# EAGLE design schematic (EAGLE 9.6.2)
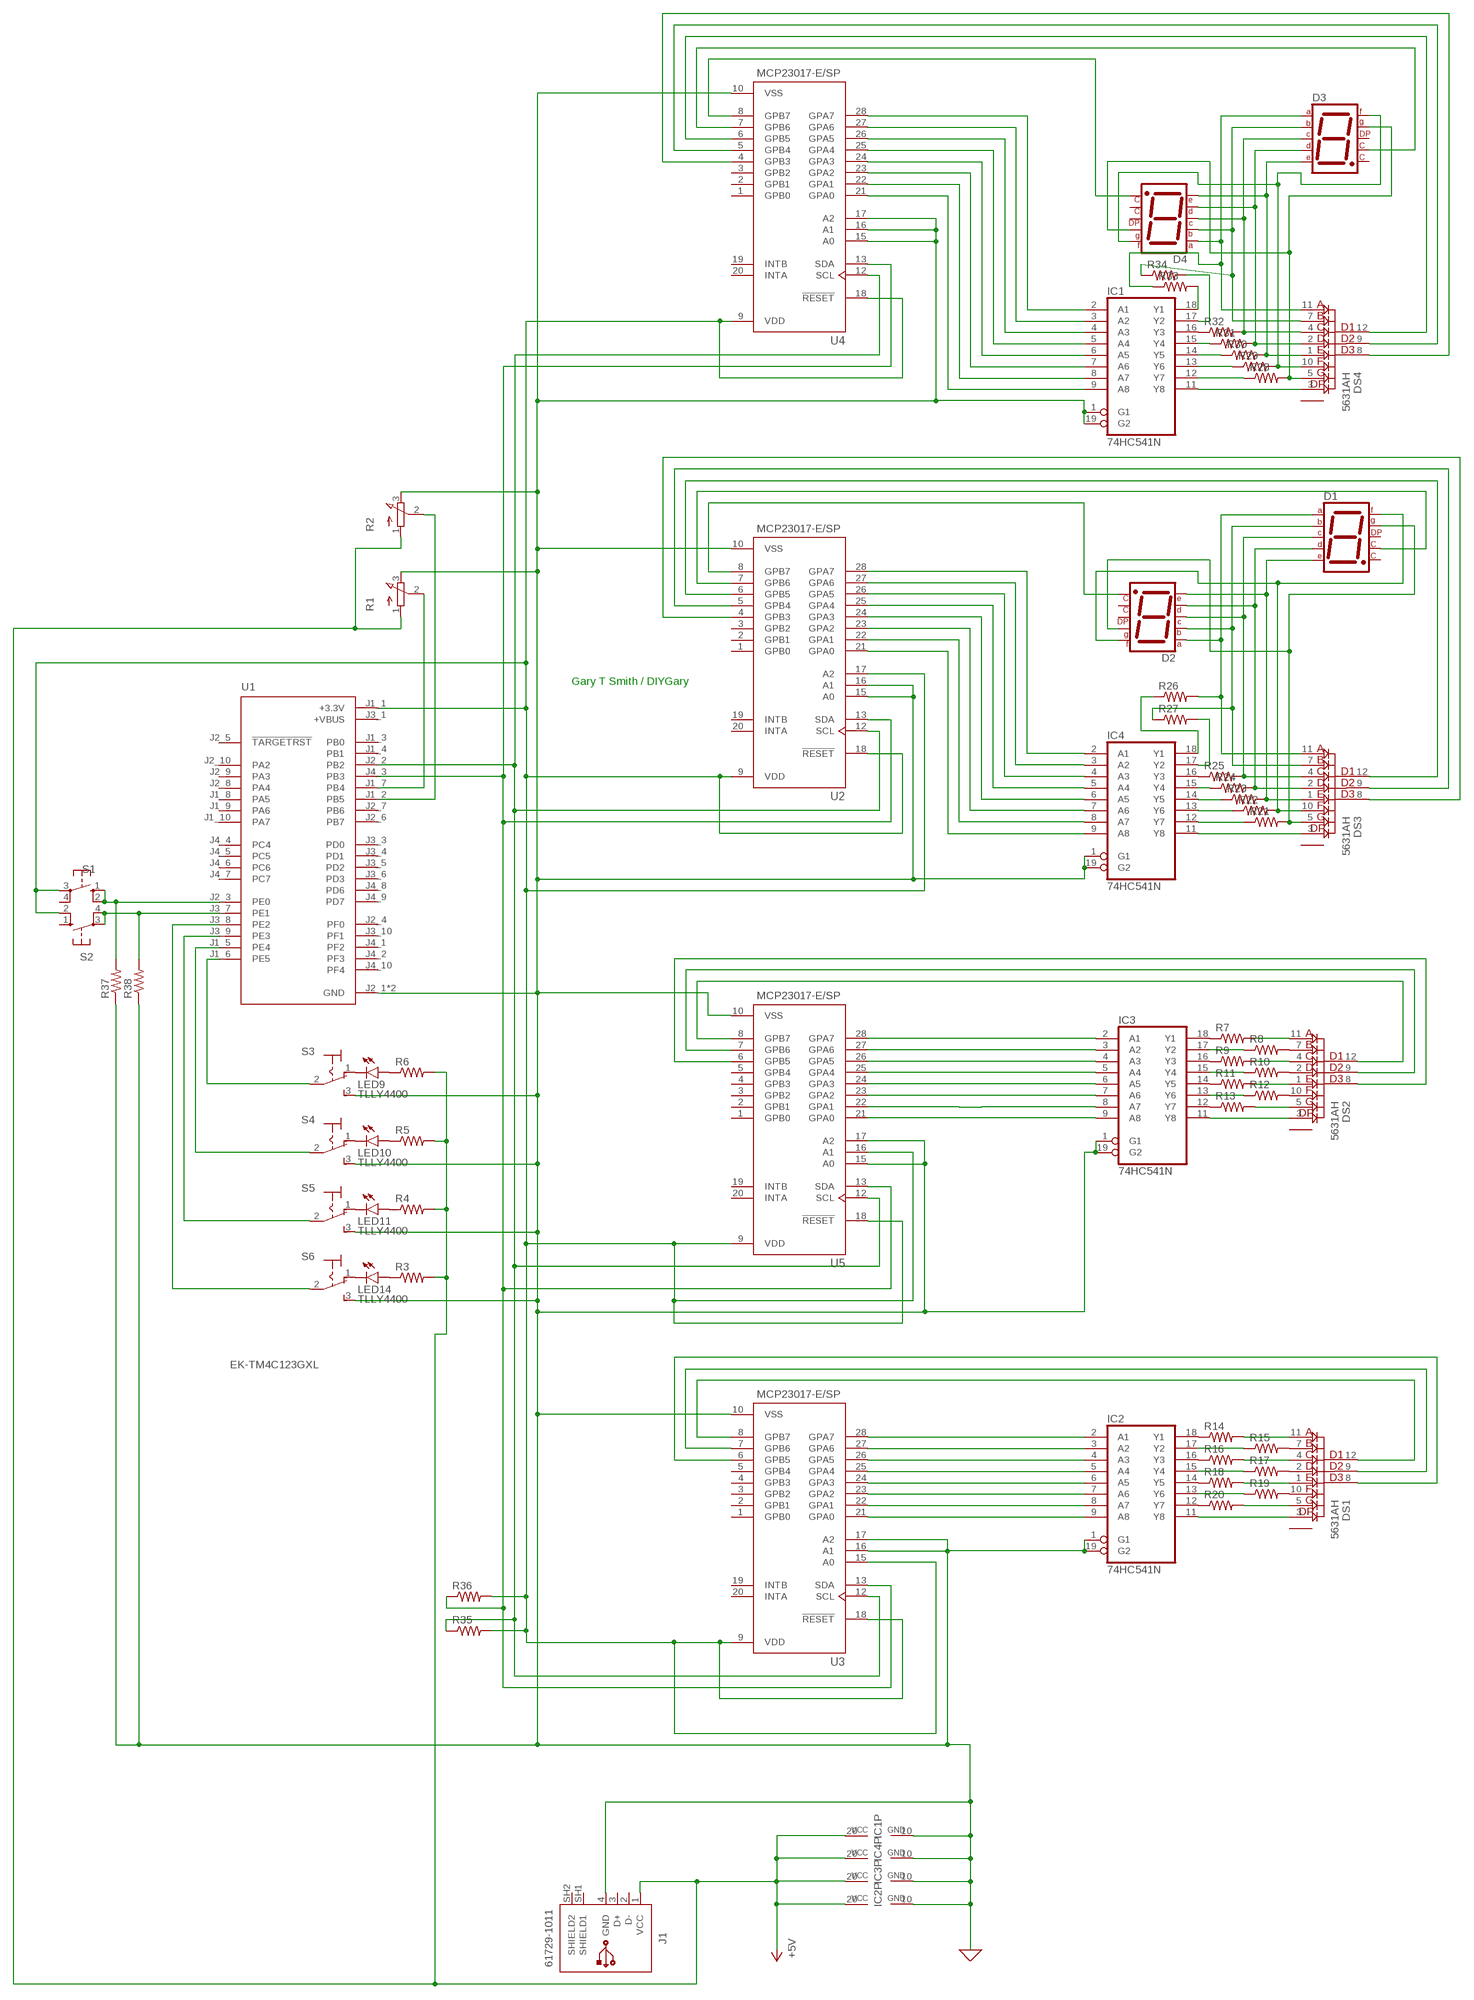
[diagram p0: schematic, sheet 1]

## Parts
D1  5611AH  [5611AH]
D2  5611AH  [5611AH]
D3  5611AH  [5611AH]
D4  5611AH  [5611AH]
DS1  5631AH  [DIPS1524W50P254L3760H835Q12N]
DS2  5631AH  [DIPS1524W50P254L3760H835Q12N]
DS3  5631AH  [DIPS1524W50P254L3760H835Q12N]
DS4  5631AH  [DIPS1524W50P254L3760H835Q12N]
IC1  74HC541N  [DIL20]
IC2  74HC541N  [DIL20]
IC3  74HC541N  [DIL20]
IC4  74HC541N  [DIL20]
J1  61729-1011  [61729-1011BLF]
LED9  TLLY4400  [LED3MM]
LED10  TLLY4400  [LED3MM]
LED11  TLLY4400  [LED3MM]
LED14  TLLY4400  [LED3MM]
R1  3RP/1610N  [3RP/1610N]
R2  3RP/1610N  [3RP/1610N]
R3  R-US_0204/7  [0204/7]
R4  R-US_0204/7  [0204/7]
R5  R-US_0204/7  [0204/7]
R6  R-US_0204/7  [0204/7]
R7  R-US_0204/7  [0204/7]
R8  R-US_0204/7  [0204/7]
R9  R-US_0204/7  [0204/7]
R10  R-US_0204/7  [0204/7]
R11  R-US_0204/7  [0204/7]
R12  R-US_0204/7  [0204/7]
R13  R-US_0204/7  [0204/7]
R14  R-US_0204/7  [0204/7]
R15  R-US_0204/7  [0204/7]
R16  R-US_0204/7  [0204/7]
R17  R-US_0204/7  [0204/7]
R18  R-US_0204/7  [0204/7]
R19  R-US_0204/7  [0204/7]
R20  R-US_0204/7  [0204/7]
R21  R-US_0204/7  [0204/7]
R22  R-US_0204/7  [0204/7]
R23  R-US_0204/7  [0204/7]
R24  R-US_0204/7  [0204/7]
R25  R-US_0204/7  [0204/7]
R26  R-US_0204/7  [0204/7]
R27  R-US_0204/7  [0204/7]
R28  R-US_0204/7  [0204/7]
R29  R-US_0204/7  [0204/7]
R30  R-US_0204/7  [0204/7]
R31  R-US_0204/7  [0204/7]
R32  R-US_0204/7  [0204/7]
R33  R-US_0204/7  [0204/7]
R34  R-US_0204/7  [0204/7]
R35  R-US_0204/7  [0204/7]
R36  R-US_0204/7  [0204/7]
R37  R-US_0204/7  [0204/7]
R38  R-US_0204/7  [0204/7]
S1  10-XX  [B3F-10XX]
S2  10-XX  [B3F-10XX]
S3  320-916  [320-916]
S4  320-916  [320-916]
S5  320-916  [320-916]
S6  320-916  [320-916]
U1  EK-TM4C123GXL  [MODULE_EK-TM4C123GXL]
U2  MCP23017-E/SP  [DIP787W45P254L3556H508Q28]
U3  MCP23017-E/SP  [DIP787W45P254L3556H508Q28]
U4  MCP23017-E/SP  [DIP787W45P254L3556H508Q28]
U5  MCP23017-E/SP  [DIP787W45P254L3556H508Q28]

## Nets
0: IC1.1(G1) IC1.10(GND) IC1.19(G2) IC2.1(G1) IC2.10(GND) IC2.19(G2) IC3.1(G1) IC3.10(GND) IC3.19(G2) IC4.1(G1) IC4.10(GND) IC4.19(G2) J1.4(GND) R1.3(E) R2.3(E) R37.1 R38.1 S3.3(S) S4.3(S) S5.3(S) S6.3(S) U1.J2_1(GND) U1.J3_2(GND) U2.10(VSS) U2.15(A0) U2.16(A1) U3.10(VSS) U3.16(A1) U3.17(A2) U4.10(VSS) U4.15(A0) U4.16(A1) U4.17(A2) U5.10(VSS) U5.15(A0) U5.17(A2) ; supply symbol labelled GND
N$1: IC1.9(A8) U4.21(GPA0)
N$2: DS1.7(A_B) R15.2
N$3: DS1.2(A_D) R17.2
N$4: DS1.10(A_F) R19.2
N$5: DS2.7(A_B) R8.2
N$6: DS2.2(A_D) R10.2
N$7: DS2.10(A_F) R12.2
N$8: D3.7(A) D4.7(A) DS4.11(A_A) R33.1
N$9: IC1.8(A7) U4.22(GPA1)
N$10: IC1.7(A6) U4.23(GPA2)
N$11: IC1.6(A5) U4.24(GPA3)
N$12: IC1.5(A4) U4.25(GPA4)
N$13: IC1.4(A3) U4.26(GPA5)
N$14: IC1.3(A2) U4.27(GPA6)
N$15: IC1.2(A1) U4.28(GPA7)
N$16: D3.3(CK1) U4.7(GPB6)
N$17: DS4.12(CC_D1) U4.6(GPB5)
N$18: DS4.9(CC_D2) U4.5(GPB4)
N$19: DS4.8(CC_D3) U4.4(GPB3)
N$20: D1.7(A) D2.7(A) DS3.11(A_A) R26.2
N$21: IC1.16(Y3) R32.1
N$22: IC1.12(Y7) R28.1
N$23: IC1.13(Y6) R29.1
N$24: D1.1(E) D2.1(E) DS3.1(A_E) R23.2
N$25: IC1.14(Y5) R30.1
N$26: IC1.15(Y4) R31.1
N$27: DS3.3(A_DP) IC4.11(Y8)
N$28: DS4.3(A_DP) IC1.11(Y8)
N$29: DS3.9(CC_D2) U2.5(GPB4)
N$30: D1.3(CK1) U2.7(GPB6)
N$31: DS3.12(CC_D1) U2.6(GPB5)
N$32: DS3.8(CC_D3) U2.4(GPB3)
N$33: IC4.9(A8) U2.21(GPA0)
N$34: IC4.8(A7) U2.22(GPA1)
N$35: IC4.7(A6) U2.23(GPA2)
N$36: IC4.6(A5) U2.24(GPA3)
N$37: IC4.5(A4) U2.25(GPA4)
N$38: IC4.4(A3) U2.26(GPA5)
N$39: IC4.3(A2) U2.27(GPA6)
N$40: IC4.2(A1) U2.28(GPA7)
N$41: IC3.18(Y1) R7.1
N$42: IC1.20(VCC) IC2.20(VCC) IC3.20(VCC) IC4.20(VCC) J1.1(VCC) R1.1(A) R2.1(A) R3.2 R4.2 R5.2 R6.2 ; supply symbol labelled +5V
N$43: IC3.16(Y3) R9.1
N$45: IC3.14(Y5) R11.1
N$47: IC3.12(Y7) R13.1
N$48: DS2.3(A_DP) IC3.11(Y8)
N$49: DS2.12(CC_D1) U5.8(GPB7)
N$50: DS2.9(CC_D2) U5.7(GPB6)
N$51: DS2.8(CC_D3) U5.6(GPB5)
N$52: IC3.2(A1) U5.28(GPA7)
N$53: IC3.3(A2) U5.27(GPA6)
N$54: IC3.4(A3) U5.26(GPA5)
N$55: IC3.5(A4) U5.25(GPA4)
N$56: IC3.6(A5) U5.24(GPA3)
N$57: IC3.7(A6) U5.23(GPA2)
N$58: IC3.8(A7) U5.22(GPA1)
N$59: IC3.9(A8) U5.21(GPA0)
N$60: IC2.2(A1) U3.28(GPA7)
N$61: IC2.3(A2) U3.27(GPA6)
N$62: IC2.4(A3) U3.26(GPA5)
N$63: IC2.5(A4) U3.25(GPA4)
N$64: IC2.6(A5) U3.24(GPA3)
N$65: IC2.7(A6) U3.23(GPA2)
N$66: IC2.8(A7) U3.22(GPA1)
N$67: IC2.9(A8) U3.21(GPA0)
N$68: IC2.18(Y1) R14.1
N$70: IC2.16(Y3) R16.1
N$72: IC2.14(Y5) R18.1
N$74: IC2.12(Y7) R20.1
N$75: DS1.3(A_DP) IC2.11(Y8)
N$76: DS1.12(CC_D1) U3.8(GPB7)
N$77: DS1.9(CC_D2) U3.7(GPB6)
N$78: DS1.8(CC_D3) U3.6(GPB5)
N$79: LED14.K(C) S6.1(O)
N$80: D2.8(CK2) U2.8(GPB7)
N$81: DS1.5(A_G) R20.2
N$82: D4.8(CK2) U4.8(GPB7)
N$83: LED10.K(C) S4.1(O)
N$87: S3.2(P) U1.J1_6(PE5)
N$88: S4.2(P) U1.J1_5(PE4)
N$89: S5.2(P) U1.J3_9(PE3)
N$90: S6.2(P) U1.J3_8(PE2)
N$91: LED14.A R3.1
N$92: LED11.K(C) S5.1(O)
N$93: LED11.A R4.1
N$95: LED9.K(C) S3.1(O)
N$96: LED10.A R5.1
N$97: LED9.A R6.1
N$98: R38.2 S2.3(P) S2.4(P1) U1.J3_7(PE1)
N$99: R37.2 S1.1(S) S1.2(S1) U1.J2_3(PE0)
N$100: R1.2(S) U1.J1_7(PB4)
N$101: R2.2(S) U1.J1_2(PB5)
N$102: R35.1 U1.J2_2(PB2) U2.12(SCL) U3.12(SCL) U4.12(SCL) U5.12(SCL)
N$103: R36.1 U1.J4_3(PB3) U2.13(SDA) U3.13(SDA) U4.13(SDA) U5.13(SDA)
N$104: R35.2 R36.2 S1.3(P) S2.2(S1) U1.J1_1(+3.3V) U2.9(VDD) U2.17(A2) U2.18(!RESET) U3.9(VDD) U3.15(A0) U3.18(!RESET) U4.9(VDD) U4.18(!RESET) U5.9(VDD) U5.16(A1) U5.18(!RESET)
N$105: IC2.13(Y6) R19.1
N$106: DS1.1(A_E) R18.2
N$107: IC2.15(Y4) R17.1
N$108: DS1.4(A_C) R16.2
N$109: IC2.17(Y2) R15.1
N$110: DS1.11(A_A) R14.2
N$111: DS2.5(A_G) R13.2
N$112: IC3.13(Y6) R12.1
N$113: DS2.1(A_E) R11.2
N$114: IC3.15(Y4) R10.1
N$115: DS2.4(A_C) R9.2
N$116: IC3.17(Y2) R8.1
N$117: DS2.11(A_A) R7.2
N$118: IC1.18(Y1) R33.2
N$119: D1.6(B) D2.6(B) DS3.7(A_B) R27.1
N$120: D1.4(C) D2.4(C) DS3.4(A_C) R25.2
N$121: D1.2(D) D2.2(D) DS3.2(A_D) R24.2
N$123: D1.9(F) D2.9(F) DS3.10(A_F) R22.2
N$124: D1.10(G) D2.10(G) DS3.5(A_G) R21.2
N$125: IC1.17(Y2) R34.2
N$126: D3.6(B) D4.6(B) DS4.7(A_B) R34.1
N$127: D3.4(C) D4.4(C) DS4.4(A_C) R32.2
N$128: D3.2(D) D4.2(D) DS4.2(A_D) R31.2
N$129: D3.1(E) D4.1(E) DS4.1(A_E) R30.2
N$130: D3.9(F) D4.9(F) DS4.10(A_F) R29.2
N$131: D3.10(G) D4.10(G) DS4.5(A_G) R28.2
N$132: IC4.16(Y3) R25.1
N$133: IC4.15(Y4) R24.1
N$134: IC4.14(Y5) R23.1
N$135: IC4.13(Y6) R22.1
N$136: IC4.12(Y7) R21.1
N$137: IC4.18(Y1) R26.1
N$138: IC4.17(Y2) R27.2
Unconnected: D1.5(DP) D1.8(CK2) D2.3(CK1) D2.5(DP) D3.5(DP) D3.8(CK2) D4.3(CK1) D4.5(DP) DS1.6(NC) DS2.6(NC) DS3.6(NC) DS4.6(NC) J1.2(D-) J1.3(D+) J1.SH1(SHIELD1) J1.SH2(SHIELD2) S1.4(P1) S2.1(S) U1.J1_3(PB0) U1.J1_4(PB1) U1.J1_8(PA5) U1.J1_9(PA6) U1.J1_10(PA7) U1.J2_4(PF0) U1.J2_5(!TARGETRST) U1.J2_6(PB7) U1.J2_7(PB6) U1.J2_8(PA4) U1.J2_9(PA3) U1.J2_10(PA2) U1.J3_3(PD0) U1.J3_4(PD1) U1.J3_5(PD2) U1.J3_6(PD3) U1.J3_10(PF1) U1.J4_1(PF2) U1.J4_2(PF3) U1.J4_4(PC4) U1.J4_5(PC5) U1.J4_6(PC6) U1.J4_7(PC7) U1.J4_8(PD6) U1.J4_9(PD7) U1.J4_10(PF4) U2.1(GPB0) U2.2(GPB1) U2.3(GPB2) U2.19(INTB) U2.20(INTA) U3.1(GPB0) U3.2(GPB1) U3.3(GPB2) U3.4(GPB3) U3.5(GPB4) U3.19(INTB) U3.20(INTA) U4.1(GPB0) U4.2(GPB1) U4.3(GPB2) U4.19(INTB) U4.20(INTA) U5.1(GPB0) U5.2(GPB1) U5.3(GPB2) U5.4(GPB3) U5.5(GPB4) U5.19(INTB) U5.20(INTA)

## Notes on the sheet
- Gary T Smith / DIYGary

## Power pins joined to a net without a drawn wire
+VBUS: U1.J3_1(+VBUS)

## Library data of the parts
D1-D4 = 5611AH:5611AH: 7-segment DISPLAY single cathode, 13 mm
DS1-DS4 = 5631AH:5631AH: LED Displays & Accessories 14mm THREE DIGIT Source: Datasheet <http://www.us.kingbright.com/images/catalog/SPEC/BC56-12SRWA.pdf>; DESCRIPTION: LED Displays & Accessories 14mm THREE DIGIT; HEIGHT: 8.35mm; MANUFACTURER_NAME: Kingbright; MANUFACTURER_PART_NUMBER: BC56-12SRWA; MOUSER_PART_NUMBER: 604-BC56-12SRWA; MOUSER_PRICE-STOCK: https://www.mouser.co.uk/ProductDetail/Kingbright/BC56-12SRWA?qs=VbHzlErGQr623J%252B7XTexpw%3D%3D
IC1-IC4 = 74xx-eu:74*541: Octal BUFFER and LINE DRIVER, 3-state
J1 = Connector_USB:61729-1011: USB(2.0) Type-B, RCPT, 4POS, THT-R/A Datasheet <https://www.amphenol-icc.com/media/wysiwyg/files/drawing/61729.pdf>; CATEGORY: Connector; CONTACTS: 4; CURRENT_RATING: 1A; DESCRIPTION: CONN RCPT USB2.0 TYPEB 4POS R/A; GENDER: Receptacle; MANUFACTURER: Amphenol ICC (FCI); MOUNT_TYPE: R/A; MPN: 61729-1011BLF; OPERATING_TEMP: -55°C to 85°C; PART_STATUS: Active; ROHS_COMPLIANT: RoHS Compliant; SERIES: 61729; SUB-CATEGORY: USB; TYPE: USB-B
LED9-LED11 LED14 = led:TLLY4400: Low Current (2mA) LED 3 mm Tinted Diffused Package color YELLOW Source: Data sheet <http://www.farnell.com/datasheets/391098.pdf>; MF: VISHAY SEMICONDUCTOR; OC_FARNELL: 1612439
R1 R2 = pot:3RP/1610N: 16mm Potentiometer one level Source: http://www.alphapotentiometers.net/html/16mm_pot_2.html
R3-R38 = rcl:R-US_: RESISTOR, American symbol; SPICEPREFIX: R
S1 S2 = switch-omron:10-XX: OMRON SWITCH; MPN: B3F-1000; OC_FARNELL: 176432; OC_NEWARK: 36M3542
S3-S6 = switch:320-916: TOGGLE SWITCH distributor RS Components
U1 = EK-TM4C123GXL:EK-TM4C123GXL: ARM® Cortex®-M4F Based MCU TM4C123G LaunchPad™ Evaluation Kit Check prices <https://pricing.snapeda.com/parts/EK-TM4C123GXL/Texas%20Instruments/view-part?ref=eda>; AVAILABILITY: Warning; DESCRIPTION: ARM® Cortex®-M4F Based MCU TM4C123G LaunchPad™ Evaluation Kit; MF: Texas Instruments; MP: EK-TM4C123GXL; PACKAGE: None; PRICE: None; PURCHASE-URL: https://pricing.snapeda.com/search/part/EK-TM4C123GXL/?ref=eda
U2-U5 = MCP23017-E_SP:MCP23017-E/SP: MCP23017 Series 5.5 V 1.7 MHz SMT 16-Bit I2C I/O Expander - SPDIP-28 Check prices <https://pricing.snapeda.com/parts/MCP23017-E/SP/Microchip%20Technology/view-part?ref=eda>; AVAILABILITY: In Stock; DESCRIPTION: I/O Expander 16 I²C 1.7MHz 28-SPDIP; MF: Microchip Technology; MP: MCP23017-E/SP; PACKAGE: DIP-28 Microchip; PRICE: None

## Board
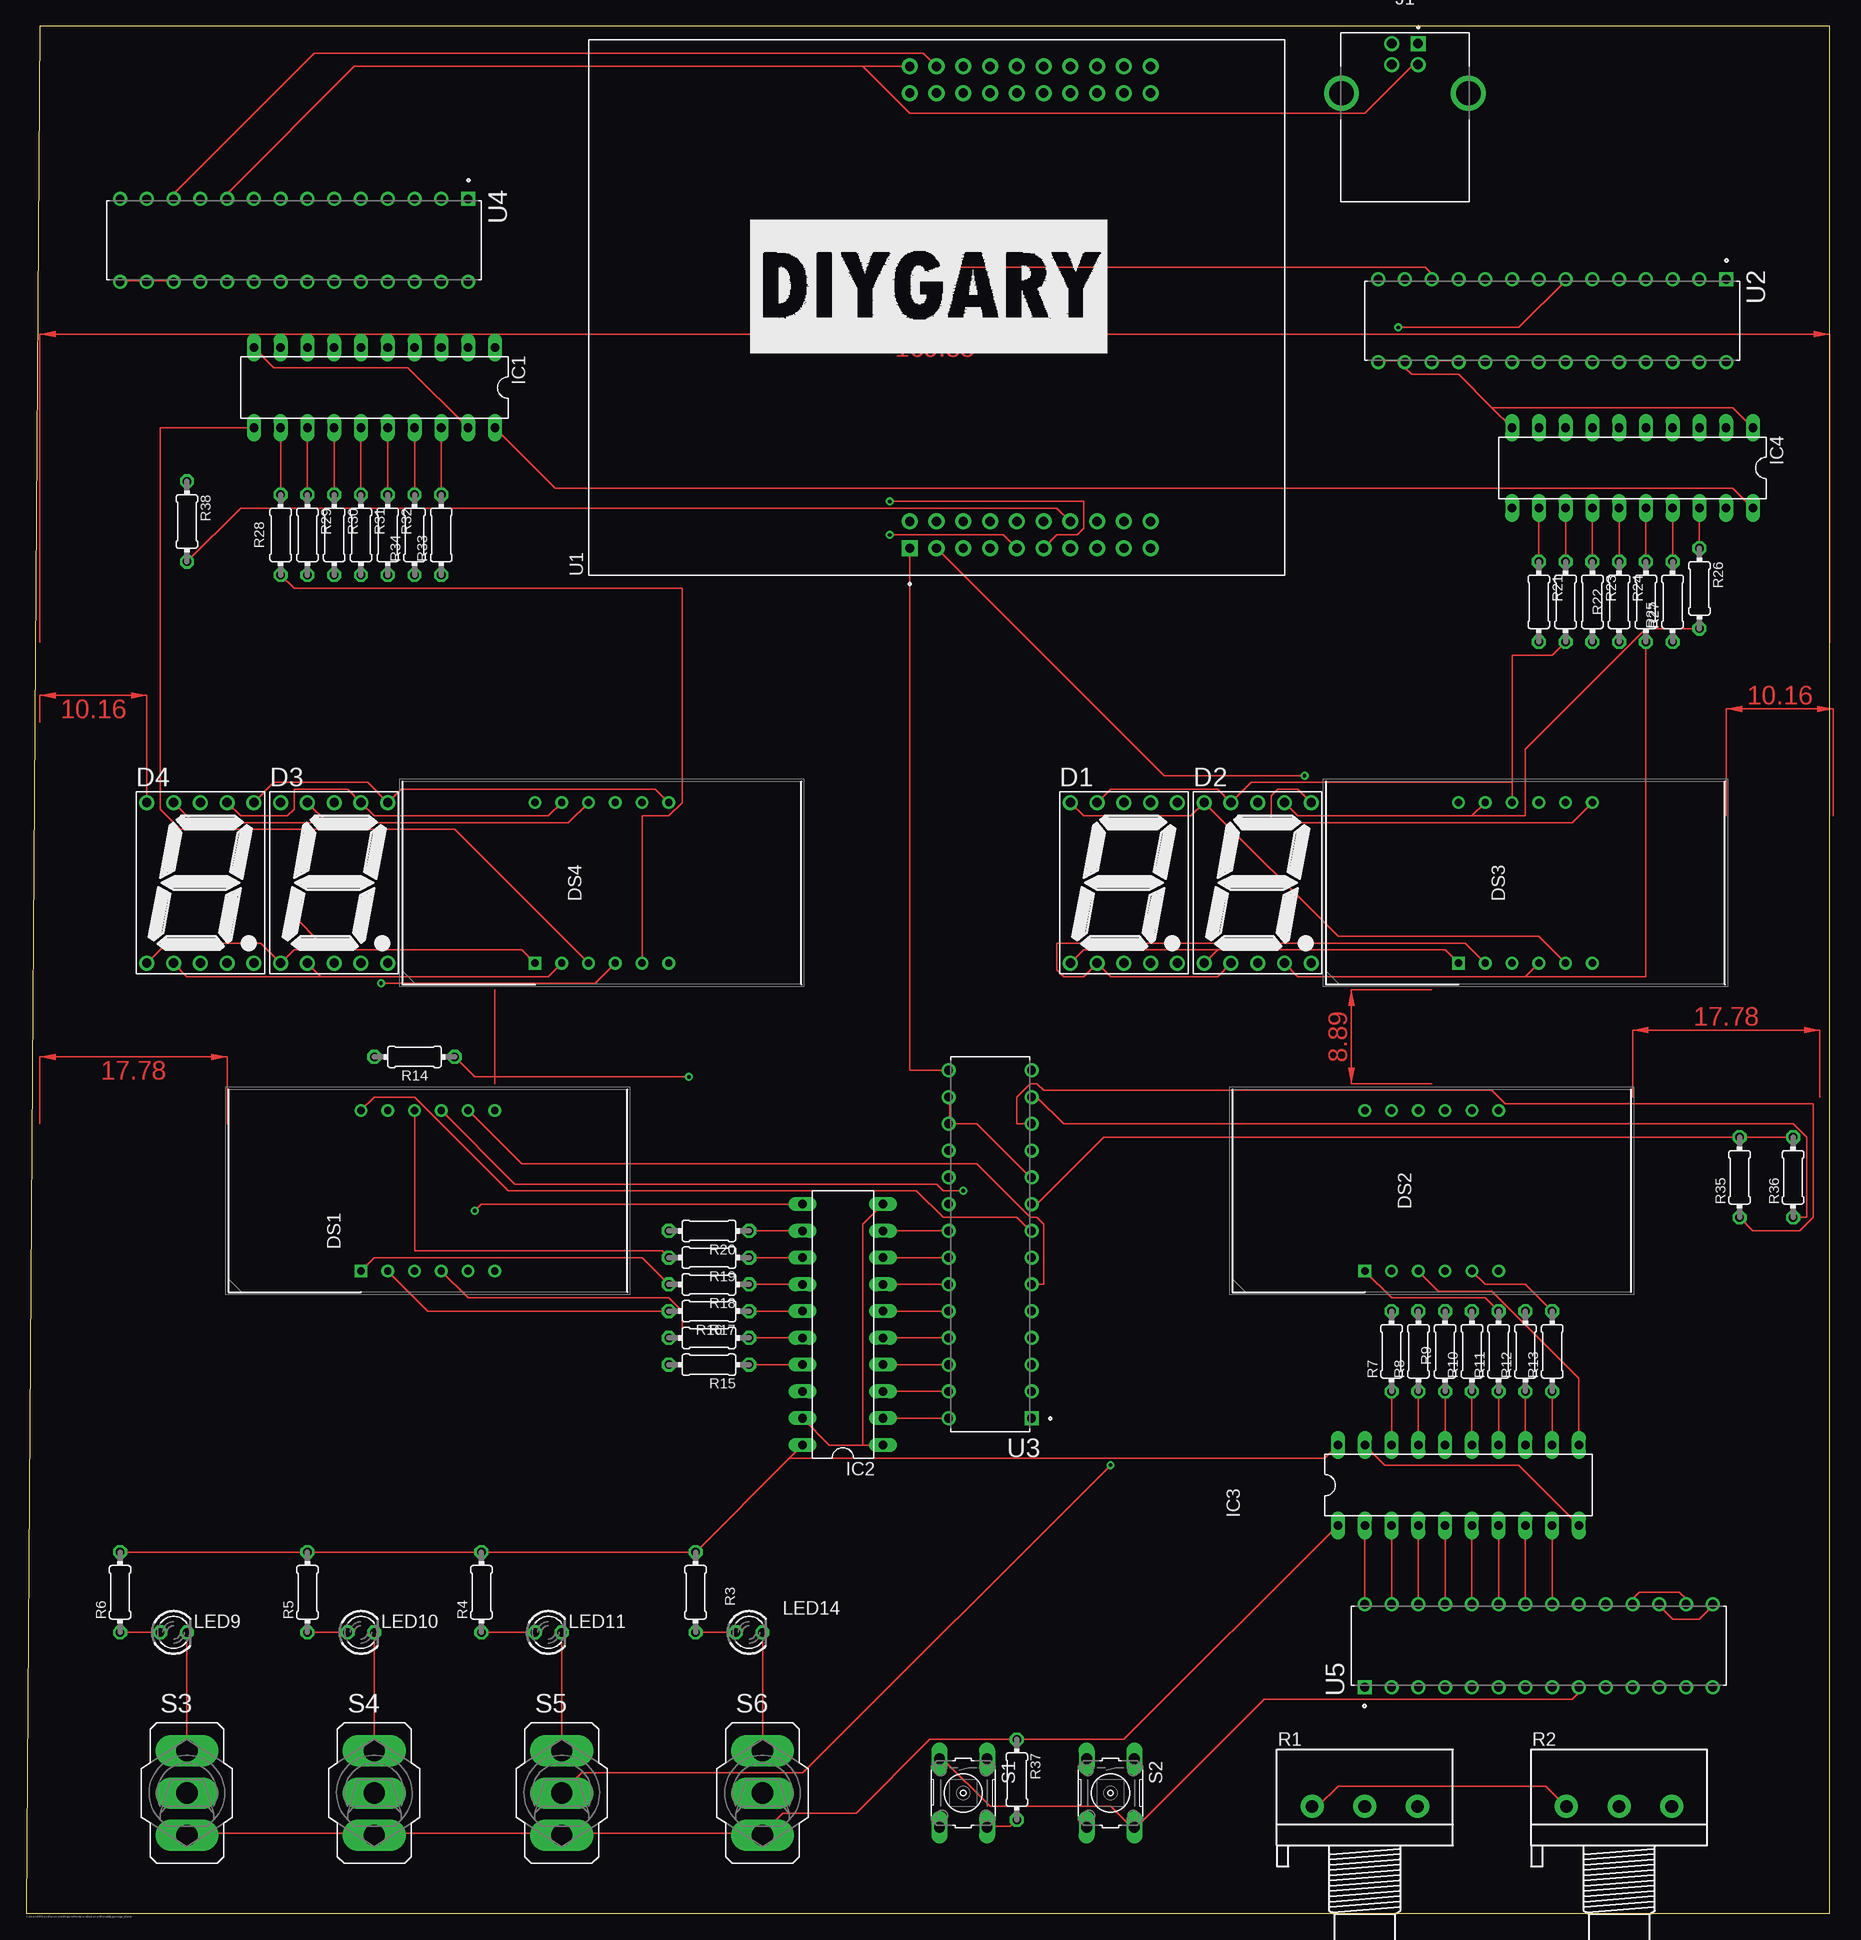
[diagram p1: board, top side]
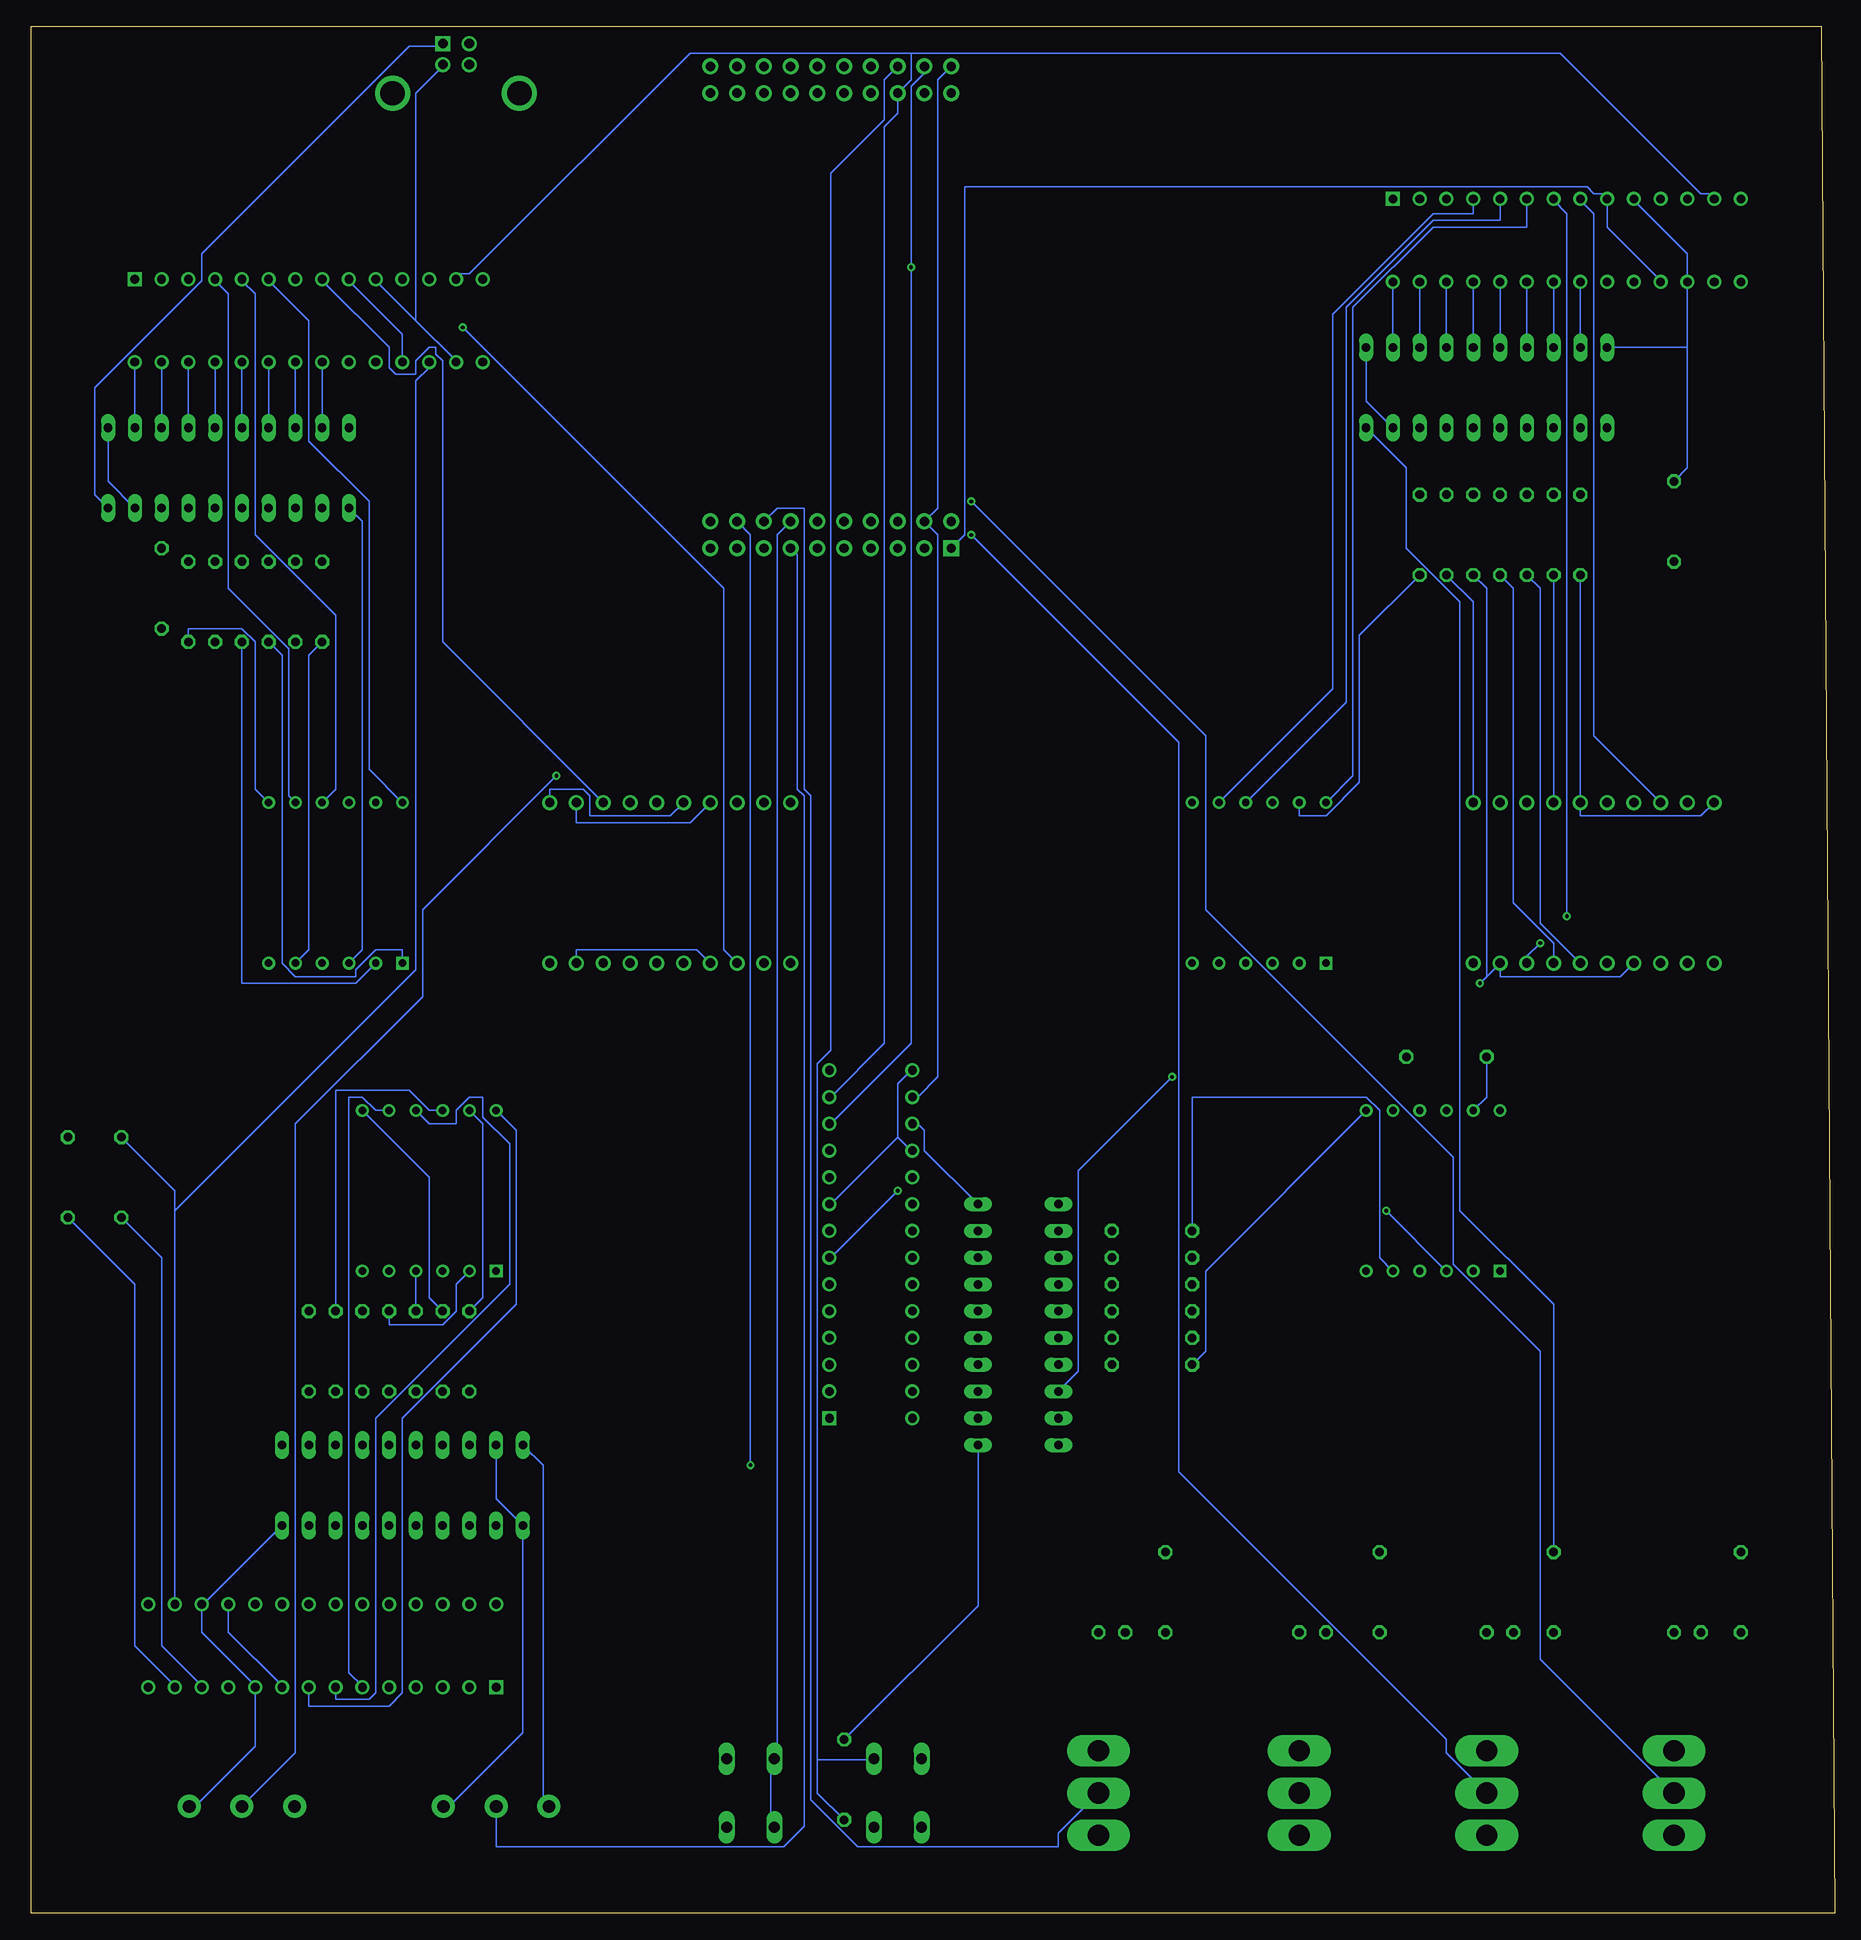
[diagram p2: board, bottom side, seen from below]

Size 171.12 x 179.06 mm. Coordinates in mm from the lower left corner, seen from the top.
Outline: 0,0 171.12,0 171.12,179.06 1.27,179.06 0,0
Copper layers (1*16): Top 0.035mm / dielectric 1.5mm / Bottom 0.035mm
Design rules "default": minimum track width 6mil, minimum drill 0.35mm, track to track 6mil, track to pad 6mil, pad to pad 6mil, via to via 6mil, smd to smd 6mil, copper to edge 40mil, drill to drill 6mil, minimum pad ring 10mil, minimum via ring 8mil, stop-mask expansion 4mil, vias tented up to drill 0mil, thermal gap 10mil

### Footprints (pad centres in the part's own frame; a part is rotated, then mirrored left to right if it is on the bottom)
5611AH = drill 0.889 pad 1.422: 1 -5.08,-7.62; 2 -2.54,-7.62; 3 0,-7.62; 4 2.54,-7.62; 5 5.08,-7.62; 6 5.08,7.62; 7 2.54,7.62; 8 0,7.62; 9 -2.54,7.62; 10 -5.08,7.62
DIPS1524W50P254L3760H835Q12N = drill 0.7 pad 1.1 square: 1 0,0 | drill 0.7 pad 1.1: 2 0,-2.54; 3 0,-5.08; 4 0,-7.62; 5 0,-10.16; 6 0,-12.7; 7 15.24,-12.7; 8 15.24,-10.16; 9 15.24,-7.62; 10 15.24,-5.08; 11 15.24,-2.54; 12 15.24,0
DIL20 = drill 0.813 long: 1 -11.43,-3.81; 2 -8.89,-3.81; 3 -6.35,-3.81; 4 -3.81,-3.81; 5 -1.27,-3.81; 6 1.27,-3.81; 7 3.81,-3.81; 8 6.35,-3.81; 9 8.89,-3.81; 10 11.43,-3.81; 11 11.43,3.81; 12 8.89,3.81; 13 6.35,3.81; 14 3.81,3.81; 15 1.27,3.81; 16 -1.27,3.81; 17 -3.81,3.81; 18 -6.35,3.81; 19 -8.89,3.81; 20 -11.43,3.81
61729-1011BLF = drill 0.92 square: 1 1.25,4.71 | drill 0.92: 2 -1.25,4.71; 3 -1.25,2.71; 4 1.25,2.71 | drill 2.3: SH1 -6.02,0; SH2 6.02,0
LED3MM = drill 0.813 octagon: A -1.27,0; K 1.27,0
3RP/1610N = drill 1.2 pad 2.184: 1 -5,0; 2 0,0; 3 5,0
0204/7 = drill 0.813 octagon: 1 -3.81,0; 2 3.81,0
B3F-10XX = drill 1.016 long: 1 -3.251,2.261; 2 3.251,2.261; 3 -3.251,-2.261; 4 3.251,-2.261
320-916 = drill 2.007 long: 1 0,4.013; 2 0,0; 3 0,-4.013
MODULE_EK-TM4C123GXL = drill 0.89 pad 1.52 square: J1_1 -22.86,2.54 | drill 0.89 pad 1.52: J1_2 -22.86,0; J1_3 -22.86,-2.54; J1_4 -22.86,-5.08; J1_5 -22.86,-7.62; J1_6 -22.86,-10.16; J1_7 -22.86,-12.7; J1_8 -22.86,-15.24; J1_9 -22.86,-17.78; J1_10 -22.86,-20.32; J2_1 22.86,2.54; J2_2 22.86,0; J2_3 22.86,-2.54; J2_4 22.86,-5.08; J2_5 22.86,-7.62; J2_6 22.86,-10.16; J2_7 22.86,-12.7; J2_8 22.86,-15.24; J2_9 22.86,-17.78; J2_10 22.86,-20.32; J3_1 -20.32,2.54; J3_2 -20.32,0; J3_3 -20.32,-2.54; J3_4 -20.32,-5.08; J3_5 -20.32,-7.62; J3_6 -20.32,-10.16; J3_7 -20.32,-12.7; J3_8 -20.32,-15.24; J3_9 -20.32,-17.78; J3_10 -20.32,-20.32; J4_1 20.32,2.54; J4_2 20.32,0; J4_3 20.32,-2.54; J4_4 20.32,-5.08; J4_5 20.32,-7.62; J4_6 20.32,-10.16; J4_7 20.32,-12.7; J4_8 20.32,-15.24; J4_9 20.32,-17.78; J4_10 20.32,-20.32
DIP787W45P254L3556H508Q28 = drill 0.82 pad 1.23 square: 1 -3.935,16.51 | drill 0.82 pad 1.23: 2 -3.935,13.97; 3 -3.935,11.43; 4 -3.935,8.89; 5 -3.935,6.35; 6 -3.935,3.81; 7 -3.935,1.27; 8 -3.935,-1.27; 9 -3.935,-3.81; 10 -3.935,-6.35; 11 -3.935,-8.89; 12 -3.935,-11.43; 13 -3.935,-13.97; 14 -3.935,-16.51; 15 3.935,-16.51; 16 3.935,-13.97; 17 3.935,-11.43; 18 3.935,-8.89; 19 3.935,-6.35; 20 3.935,-3.81; 21 3.935,-1.27; 22 3.935,1.27; 23 3.935,3.81; 24 3.935,6.35; 25 3.935,8.89; 26 3.935,11.43; 27 3.935,13.97; 28 3.935,16.51

### Placement (x,y rotation side)
D1  104.14,97.79 0 top
D2  116.84,97.79 0 top
D3  29.21,97.79 0 top
D4  16.51,97.79 0 top
DS1  31.75,60.96 90 top
DS2  127,60.96 90 top
DS3  135.89,90.17 90 top
DS4  48.26,90.17 90 top
IC1  33.02,144.78 180 top
IC2  77.47,55.88 90 top
IC3  135.89,40.64 0 top
IC4  152.4,137.16 180 top
J1  130.81,172.72 0 top
LED9  13.97,26.67 0 top
LED10  31.75,26.67 0 top
LED11  49.53,26.67 0 top
LED14  68.58,26.67 0 top
R1  127,10.16 0 top
R2  151.13,10.16 0 top
R3  63.5,30.48 90 top
R4  43.18,30.48 90 top
R5  26.67,30.48 90 top
R6  8.89,30.48 90 top
R7  129.54,53.34 90 top
R8  132.08,53.34 90 top
R9  134.62,53.34 90 top
R10  137.16,53.34 90 top
R11  139.7,53.34 90 top
R12  142.24,53.34 90 top
R13  144.78,53.34 90 top
R14  36.83,81.28 180 top
R15  64.77,52.07 180 top
R16  64.77,54.61 180 top
R17  64.77,57.15 180 top
R18  64.77,59.69 180 top
R19  64.77,62.23 180 top
R20  64.77,64.77 180 top
R21  143.51,124.46 270 top
R22  146.05,124.46 270 top
R23  148.59,124.46 270 top
R24  151.13,124.46 270 top
R25  153.67,124.46 270 top
R26  158.75,125.73 270 top
R27  156.21,124.46 90 top
R28  24.13,130.81 270 top
R29  26.67,130.81 270 top
R30  29.21,130.81 270 top
R31  31.75,130.81 270 top
R32  34.29,130.81 270 top
R33  39.37,130.81 90 top
R34  36.83,130.81 90 top
R35  162.56,69.85 90 top
R36  167.64,69.85 90 top
R37  93.98,12.7 270 top
R38  15.24,132.08 270 top
S1  88.9,11.43 270 top
S2  102.87,11.43 270 top
S3  15.24,11.43 0 top
S4  33.02,11.43 0 top
S5  50.8,11.43 0 top
S6  69.85,11.43 0 top
U1  86.36,152.4 90 top
U2  144.78,151.13 270 top
U3  91.44,63.5 180 top
U4  25.4,158.75 270 top
U5  143.51,25.4 90 top

### Tracks (layer width: path | path; a pad name or v marks a point on that pad's centre or on a via)
0
  Top 0.152: 139.06,142.88 135.89,146.05 131.44,146.05 130.81,146.69 U2.16 130.81,147.32 128.27,147.32 U2.15 | 139.06,142.88 IC4.10 | IC4.1 161.93,142.88 139.06,142.88 | U5.15 160.02,29.21 158.75,27.94 156.21,27.94 154.94,29.21 U5.17 | IC3.10 141.6,42.55 128.91,42.55 IC3.19 | 33.02,7.62 15.24,7.62 S3.3 | 33.02,7.62 50.8,7.62 | 33.02,7.62 S4.3 | 50.8,7.62 69.85,7.62 | 50.8,7.62 S5.3 | 11.43,154.94 8.89,154.94 U4.15 | 11.43,154.94 13.97,154.94 U4.17 | 11.43,154.94 U4.16 | IC1.19 36.2,146.69 23.5,146.69 IC1.10 | 87.63,74.93 87.63,77.47 U3.16 | 87.63,74.93 90.17,74.93 95.25,69.85 U3.10 | 87.63,74.93 U3.17 | IC2.19 76.2,44.45 79.38,44.45 | IC2.1 79.38,44.45 | IC2.10 79.38,65.41 79.38,44.45 | U1.J2_1 79.38,175.26 | 79.38,175.26 31.11,175.26 19.05,163.19 U4.10 | 69.85,7.62 71.75,9.53 78.74,9.53 85.72,16.51 R37.1 104.14,16.51 IC3.1 | 69.85,7.62 S6.3 | 79.38,175.26 83.82,170.81 127,170.81 131.44,175.26 J1.4
  Bottom 0.152: IC4.19 163.83,135.89 IC4.1 | 134.62,151.13 130.81,147.32 U2.16 | 134.62,151.13 138.43,154.94 U2.10 | 134.62,151.13 134.62,172.72 132.08,175.26 J1.4 | 154.94,29.21 IC3.10 | 154.94,29.21 154.94,26.67 149.86,21.59 U5.10 149.86,15.88 155.57,10.16 R2.3 | 154.94,29.21 U5.17 | IC3.19 127,39.37 IC3.1 124.46,17.14 131.44,10.16 R1.3 | IC1.19 44.45,143.51 IC1.1 | R38.1 13.97,137.16 13.97,148.59 | 13.97,148.59 U4.17 13.97,157.48 19.05,162.56 U4.10 | 13.97,148.59 IC1.10 | U1.J2_1 85.09,173.99 85.09,133.35 U1.J3_2 85.09,130.81 85.09,79.38 87,77.47 U3.16 | IC2.10 86.36,72.39 86.36,74.3 87,74.93 U3.17 | R37.1 81.28,29.21 IC2.1
N$1
  Bottom 0.152: U4.21 IC1.9
N$2
  Bottom 0.152: DS1.7 59.69,60.96 59.69,53.34 R15.2
N$3
  Top 0.152: DS1.2 38.1,57.15 R17.2
N$4
  Top 0.152: DS1.10 36.83,62.87 60.33,62.87 R19.2
N$5
  Bottom 0.152: DS2.7 133.35,69.85 133.35,58.42 R8.2
N$6
  Bottom 0.152: DS2.2 130.81,59.69 130.81,57.15 132.08,55.88 137.16,55.88 R10.2
N$7
  Bottom 0.152: DS2.10 133.35,76.2 135.25,78.11 142.24,78.11 R12.2
N$8
  Top 0.152: DS4.11 49.53,104.14 33.02,104.14 D3.7 30.48,106.68 25.4,106.68 25.4,104.78 24.77,104.14 20.32,104.14 D4.7
  Bottom 0.152: R33.1 45.09,121.28 45.09,107.31 48.26,104.14 50.8,104.14 DS4.11
N$9
  Bottom 0.152: U4.22 IC1.8
N$10
  Bottom 0.152: U4.23 IC1.7
N$11
  Bottom 0.152: U4.24 IC1.6
N$12
  Bottom 0.152: U4.25 IC1.5
N$13
  Bottom 0.152: U4.26 IC1.4
N$14
  Bottom 0.152: U4.27 IC1.3
N$15
  Bottom 0.152: U4.28 IC1.2
N$16  (via drill 0.35)
  Top 0.152: v27.94,92.08 v25.4,94.61
  Bottom 0.152: v25.4,94.61 25.4,161.29 26.67,162.56 U4.7 | v27.94,92.08 29.21,90.81 D3.3
N$17
  Bottom 0.152: DS4.12 45.72,107.95 45.72,152.4 38.1,160.02 29.21,160.02 U4.6
N$18
  Bottom 0.152: DS4.9 46.35,114.94 46.35,152.4 38.1,160.66 31.75,160.66 U4.5
N$19
  Bottom 0.152: DS4.8 47.62,116.2 47.62,151.76 38.1,161.29 34.29,161.29 U4.4
N$20
  Top 0.152: 137.16,104.14 DS3.11 | 137.16,104.14 120.65,104.14 D2.7 | R26.2 153.67,121.92 142.24,110.49 142.24,104.14 137.16,104.14
  Bottom 0.152: D1.7 108.58,103.5 119.38,103.5 D2.7
N$21
  Top 0.152: IC1.16 R32.1
N$22
  Top 0.152: IC1.12 R28.1
N$23
  Top 0.152: IC1.13 R29.1
N$24
  Top 0.152: DS3.1 134.62,91.44 113.03,91.44 | D2.1 113.03,91.44 | D1.1 100.33,91.44 113.03,91.44
  Bottom 0.152: R23.2 147.32,119.38 147.32,90.17 146.05,88.9 140.34,88.9 140.34,89.53 138.43,91.44 135.89,91.44 DS3.1
N$25
  Top 0.152: IC1.14 R30.1
N$26
  Top 0.152: IC1.15 R31.1
N$27
  Bottom 0.152: DS3.3 139.7,91.44 139.7,132.08 IC4.11
N$28
  Top 0.152: DS4.3 40.64,102.87 14.61,102.87 12.7,104.78 12.7,140.97 IC1.11
N$29
  Bottom 0.152: DS3.9 142.24,106.68 142.24,123.19 149.86,130.81 149.86,153.67 151.13,154.94 U2.5
N$30  (via drill 0.35)
  Top 0.152: v130.18,150.5 141.6,150.5 146.05,154.94 U2.7
  Bottom 0.152: v130.18,150.5 105.41,125.73 105.41,91.44 D1.3
N$31
  Bottom 0.152: DS3.12 139.06,108.58 139.06,133.99 144.78,139.7 144.78,151.13 148.59,154.94 U2.6
N$32
  Bottom 0.152: DS3.8 146.69,106.05 146.69,120.02 152.4,125.73 152.4,153.67 153.67,154.94 U2.4
N$33
  Bottom 0.152: U2.21 IC4.9
N$34
  Bottom 0.152: U2.22 IC4.8
N$35
  Bottom 0.152: U2.23 IC4.7
N$36
  Bottom 0.152: U2.24 IC4.6
N$37
  Bottom 0.152: U2.25 IC4.5
N$38
  Bottom 0.152: U2.26 IC4.4
N$39
  Bottom 0.152: U2.27 IC4.3
N$40
  Bottom 0.152: U2.28 IC4.2
N$41
  Top 0.152: R7.1 IC3.18
N$42
  Top 0.152: IC1.20 50.16,135.25 161.93,135.25 IC4.20 | R2.1 146.05,10.16 144.15,12.06 124.46,12.06 122.56,10.16 R1.1 | IC2.20 72.39,43.18 | 72.39,43.18 R3.2 R4.2 R5.2 R6.2 | IC3.20 123.19,43.18 72.39,43.18
  Bottom 0.152: J1.1 132.08,177.16 135.25,177.16 154.94,157.48 154.94,154.94 165.1,144.78 165.1,134.62 IC4.20 | IC3.20 122.56,42.55 122.56,10.16 R1.1 | IC1.20 40.64,137.16 40.64,129.54 35.56,124.46 35.56,66.67 26.67,57.78 R5.2
N$43
  Top 0.152: R9.1 IC3.16
N$45
  Top 0.152: R11.1 IC3.14
N$47
  Top 0.152: R13.1 IC3.12
N$48
  Top 0.152: DS2.3 133.99,59.05 139.06,59.05 147.32,50.8 IC3.11
N$49
  Bottom 0.152: DS2.12 125.09,74.3 125.09,57.78 135.89,46.99 135.89,20.95 137.16,19.68 144.78,19.68 U5.8
N$50
  Bottom 0.152: DS2.9 133.35,74.93 130.81,74.93 130.81,76.2 129.54,77.47 128.27,77.47 128.27,75.56 125.73,73.03 125.73,59.69 138.43,46.99 138.43,20.95 139.06,20.32 142.24,20.32 U5.7
N$51
  Bottom 0.152: DS2.8 138.43,76.2 139.7,77.47 140.97,77.47 140.97,22.86 139.7,21.59 U5.6
N$52
  Top 0.152: U5.28 IC3.2
N$53
  Top 0.152: U5.27 IC3.3
N$54
  Top 0.152: U5.26 IC3.4
N$55
  Top 0.152: U5.25 IC3.5
N$56
  Top 0.152: U5.24 IC3.6
N$57
  Top 0.152: U5.23 IC3.7
N$58
  Top 0.152: U5.22 IC3.8
N$59
  Top 0.152: U5.21 IC3.9
N$60
  Top 0.152: U3.28 IC2.2
N$61
  Top 0.152: U3.27 IC2.3
N$62
  Top 0.152: U3.26 IC2.4
N$63
  Top 0.152: U3.25 IC2.5
N$64
  Top 0.152: U3.24 IC2.6
N$65
  Top 0.152: U3.23 IC2.7
N$66
  Top 0.152: U3.22 IC2.8
N$67
  Top 0.152: U3.21 IC2.9
N$68  (via drill 0.35)
  Top 0.152: R14.1 42.55,79.38 v62.87,79.38
  Bottom 0.152: v62.87,79.38 71.75,70.48 71.75,51.44 IC2.18
N$70
  Top 0.152: IC2.16 R16.1
N$72
  Top 0.152: IC2.14 R18.1
N$74
  Top 0.152: IC2.12 R20.1
N$75  (via drill 0.35)
  Top 0.152: v42.55,66.67 43.18,67.31 IC2.11
  Bottom 0.152: v42.55,66.67 DS1.3
N$76
  Top 0.152: DS1.12 33.02,77.47 36.83,77.47 45.72,68.58 84.45,68.58 87,66.04 93.98,66.04 95.25,64.77 U3.8
N$77  (via drill 0.35)
  Top 0.152: DS1.9 46.35,69.22 86.36,69.22 87,68.58 v88.9,68.58
  Bottom 0.152: v88.9,68.58 95.25,62.23 U3.7
N$78
  Top 0.152: DS1.8 46.99,71.12 90.17,71.12 95.25,66.04 95.89,66.04 96.52,65.41 96.52,59.69 U3.6
N$79
  Top 0.152: S6.1 LED14.K
N$80
  Bottom 0.152: D2.8 132.08,120.65 132.08,147.32 132.72,147.96 132.72,148.59 133.35,148.59 134.62,147.32 134.62,146.05 136.53,146.05 137.16,146.69 137.16,148.59 143.51,154.94 U2.8
N$81
  Bottom 0.152: DS1.5 43.18,62.23 43.18,76.2 44.45,77.47 60.96,77.47 R20.2
N$82
  Bottom 0.152: D4.8 22.86,111.76 22.86,161.29 24.13,162.56 U4.8
N$83
  Top 0.152: S4.1 LED10.K
N$87  (via drill 0.35)
  Top 0.152: U1.J1_6 97.79,130.81 99.69,130.81 100.33,131.44 100.33,133.99 v81.92,133.99
  Bottom 0.152: v81.92,133.99 59.69,111.76 59.69,95.25 36.2,71.75 36.2,61.59 27.94,53.34 27.94,24.13 S3.2
N$88  (via drill 0.35)
  Top 0.152: U1.J1_5 92.71,130.81 v81.92,130.81
  Bottom 0.152: v81.92,130.81 62.23,111.12 62.23,41.91 36.83,16.51 36.83,15.24 S4.2
N$89  (via drill 0.35)
  Top 0.152: v102.87,42.55 73.66,13.34 52.7,13.34 S5.2
  Bottom 0.152: U1.J3_9 102.87,130.81 v102.87,42.55
N$90
  Bottom 0.152: U1.J3_8 100.33,133.35 97.79,133.35 97.79,106.68 97.16,106.05 97.16,10.79 92.71,6.35 73.66,6.35 73.66,7.62 S6.2
N$91
  Top 0.152: LED14.A R3.1
N$92
  Top 0.152: S5.1 LED11.K
N$93
  Top 0.152: LED11.A R4.1
N$95
  Top 0.152: S3.1 LED9.K
N$96
  Top 0.152: LED10.A R5.1
N$97
  Top 0.152: LED9.A R6.1
N$98
  Top 0.152: R38.2 20.32,133.35 97.79,133.35 U1.J3_7
  Bottom 0.152: S2.4 100.97,8.26 100.97,14.61 S2.3 100.33,15.24 100.33,130.81 U1.J3_7
N$99
  Top 0.152: R37.2 93.34,8.26 91.44,8.26 S1.2
  Bottom 0.152: U1.J2_3 90.17,173.99 90.17,170.18 95.25,165.1 95.25,81.92 96.52,80.64 96.52,14.61 | 96.52,14.61 96.52,11.43 R37.2 | 96.52,14.61 91.44,14.61 S1.1
N$100
  Bottom 0.152: U1.J1_7 98.42,128.91 98.42,106.68 97.79,106.05 97.79,8.26 99.69,6.35 127,6.35 R1.2
N$101  (via drill 0.35)
  Top 0.152: U1.J1_2 107.95,107.95 v121.28,107.95
  Bottom 0.152: v121.28,107.95 133.99,95.25 133.99,87 146.05,74.93 146.05,15.24 R2.2
N$102  (via drill 0.35)
  Top 0.152: U4.12 13.97,163.19 27.3,176.53 85.09,176.53 U1.J2_2 | v87.63,156.21 132.72,156.21 133.35,155.57 U2.12 | R35.1 163.83,64.77 168.28,64.77 169.54,66.04 169.54,76.83 140.34,76.83 139.06,78.11 96.52,78.11 95.89,78.74 95.25,78.74 93.98,77.47 93.98,74.93 U3.12
  Bottom 0.152: R35.1 158.75,62.23 158.75,25.4 154.94,21.59 U5.12 | U1.J2_2 86.36,174.62 87.63,173.35 v87.63,156.21 87.63,82.55 95.25,74.93 U3.12
N$103
  Top 0.152: R36.1 168.91,66.04 168.91,73.66 167.64,74.93 98.42,74.93 95.89,77.47 U3.13
  Bottom 0.152: 87.63,176.53 108.58,176.53 129.54,155.57 130.81,155.57 U2.13 | 87.63,176.53 26.04,176.53 12.7,163.19 11.43,163.19 U4.13 | R36.1 161.29,59.69 161.29,25.4 157.48,21.59 U5.13 | 87.63,176.53 87.63,173.99 U1.J4_3 88.9,170.81 90.17,169.54 90.17,82.55 95.25,77.47 U3.13
N$104
  Top 0.152: U1.J1_1 83.82,80.01 U3.15 | S1.3 87,14.61 91.44,10.16 102.87,10.16 104.78,8.26 S2.2 105.41,8.26 117.47,20.32 146.69,20.32 147.32,20.95 U5.9 | U2.17 133.35,147.32 135.89,147.32 U2.18 | R36.2 R35.2 102.23,73.66 95.89,67.31 U3.9 | U5.16 157.48,29.84 156.84,30.48 153.03,30.48 152.4,29.84 U5.18
  Bottom 0.152: U4.18 16.51,154.94 21.59,160.02 U4.9 21.59,163.19 22.86,163.19 23.5,163.83 82.55,163.83 82.55,130.81 U1.J1_1 | 88.9,73.66 87.63,72.39 U3.18 | 88.9,73.66 88.9,78.74 87.63,80.01 U3.15 | 88.9,73.66 95.25,67.31 U3.9 | U2.18 135.89,149.86 140.97,154.94 U2.9 | U5.18 152.4,26.67 147.32,21.59 U5.9 | R35.2 157.48,68.58 157.48,66.67 | U5.16 157.48,66.67 | 157.48,66.67 134.62,89.53 134.62,145.41 133.35,146.69 U2.17
N$105
  Top 0.152: IC2.13 R19.1
N$106
  Top 0.152: DS1.1 33.02,62.23 58.42,62.23 R18.2
N$107
  Top 0.152: IC2.15 R17.1
N$108
  Top 0.152: DS1.4 41.91,58.42 60.96,58.42 62.23,57.15 62.23,54.61 R16.2
N$109
  Top 0.152: IC2.17 R15.1
N$110
  Bottom 0.152: DS1.11 33.02,77.47 R14.2
N$111
  Top 0.152: DS2.5 138.43,59.69 142.24,59.69 R13.2
N$112
  Top 0.152: R12.1 IC3.13
N$113
  Top 0.152: DS2.1 129.54,58.42 138.43,58.42 R11.2
N$114
  Top 0.152: R10.1 IC3.15
N$115
  Bottom 0.152: R9.2 DS2.4
N$116
  Top 0.152: R8.1 IC3.17
N$117
  Bottom 0.152: DS2.11 128.27,74.93 128.27,58.42 R7.2
N$118
  Top 0.152: IC1.18 R33.2
N$119
  Top 0.152: D2.6 120.65,106.68 118.75,106.68 118.11,106.05 118.11,103.5 146.69,103.5 DS3.7
  Bottom 0.152: D1.6 110.49,104.14 118.11,104.14 118.11,106.05 118.75,106.68 121.92,106.68 D2.6 | DS3.7 149.86,106.68 149.86,120.65 151.13,121.92 156.21,121.92 R27.1
N$120
  Top 0.152: 142.24,88.9 DS3.4 | 142.24,88.9 120.65,88.9 D2.4 | R25.2 153.67,88.9 142.24,88.9
  Bottom 0.152: D1.4 107.95,91.44 119.38,91.44 D2.4
N$121
  Top 0.152: D2.2 113.03,88.9 102.87,88.9 D1.2 100.33,88.9 98.42,88.9 97.79,89.53 97.79,92.08 136.53,92.08 DS3.2
  Bottom 0.152: DS3.2 140.34,88.27 151.13,88.27 R24.2
N$123
  Top 0.152: D1.9 102.87,106.68 113.03,106.68 D2.9 116.2,107.31 140.97,107.31 | 140.97,107.31 140.97,119.38 144.78,119.38 R22.2 | 140.97,107.31 DS3.10
N$124
  Top 0.152: D1.10 100.33,104.14 110.49,104.14 D2.10 124.46,92.71 143.51,92.71 DS3.5
  Bottom 0.152: DS3.5 144.78,91.44 144.78,119.38 R21.2
N$125
  Top 0.152: IC1.17 R34.2
N$126
  Top 0.152: DS4.7 59.69,106.68 35.56,106.68 D3.6 32.38,107.31 23.5,107.31 D4.6
  Bottom 0.152: R34.1 34.29,124.46 D3.6
N$127  (via drill 0.35)
  Top 0.152: DS4.4 53.98,88.27 v33.66,88.27
  Bottom 0.152: 33.02,88.9 D3.4 31.75,88.9 20.32,88.9 D4.4 | 33.02,88.9 v33.66,88.27 | R32.2 33.02,125.73 33.02,88.9
N$128
  Top 0.152: DS4.2 49.53,88.9 27.94,88.9 | D3.2 27.94,88.9 | D4.2 15.24,88.9 27.94,88.9
  Bottom 0.152: R31.2 30.48,125.73 30.48,95.89 26.67,92.08 D3.2
N$129
  Top 0.152: DS4.1 46.99,91.44 25.4,91.44 D3.1 22.23,92.08 13.34,92.08 D4.1
  Bottom 0.152: R30.2 27.94,125.73 27.94,93.98 D3.1
N$130
  Top 0.152: DS4.10 51.44,103.5 28.57,103.5 | D3.9 28.57,103.5 | D4.9 15.88,103.5 28.57,103.5
  Bottom 0.152: D3.9 R29.2
N$131
  Top 0.152: DS4.5 58.42,104.14 60.96,104.14 62.23,105.41 62.23,125.73 25.4,125.73 R28.2
  Bottom 0.152: D4.10 12.7,104.14 24.13,104.14 D3.10 R28.2
N$132
  Top 0.152: IC4.16 R25.1
N$133
  Top 0.152: IC4.15 R24.1
N$134
  Top 0.152: IC4.14 R23.1
N$135
  Top 0.152: IC4.13 R22.1
N$136
  Top 0.152: IC4.12 R21.1
N$137
  Top 0.152: IC4.18 R26.1
N$138
  Top 0.152: IC4.17 R27.2
(copper drawn outside any net)
  shapes: Top area x7

### Text on the board
tPlace: C:/Users/DIYGary/Documents/Projects/Hardware/InstrumentPanel/diygarylogo_B.bmp